# EAGLE design base_cdh1.0 (EAGLE 5.00)

## Sheet 1 of 2
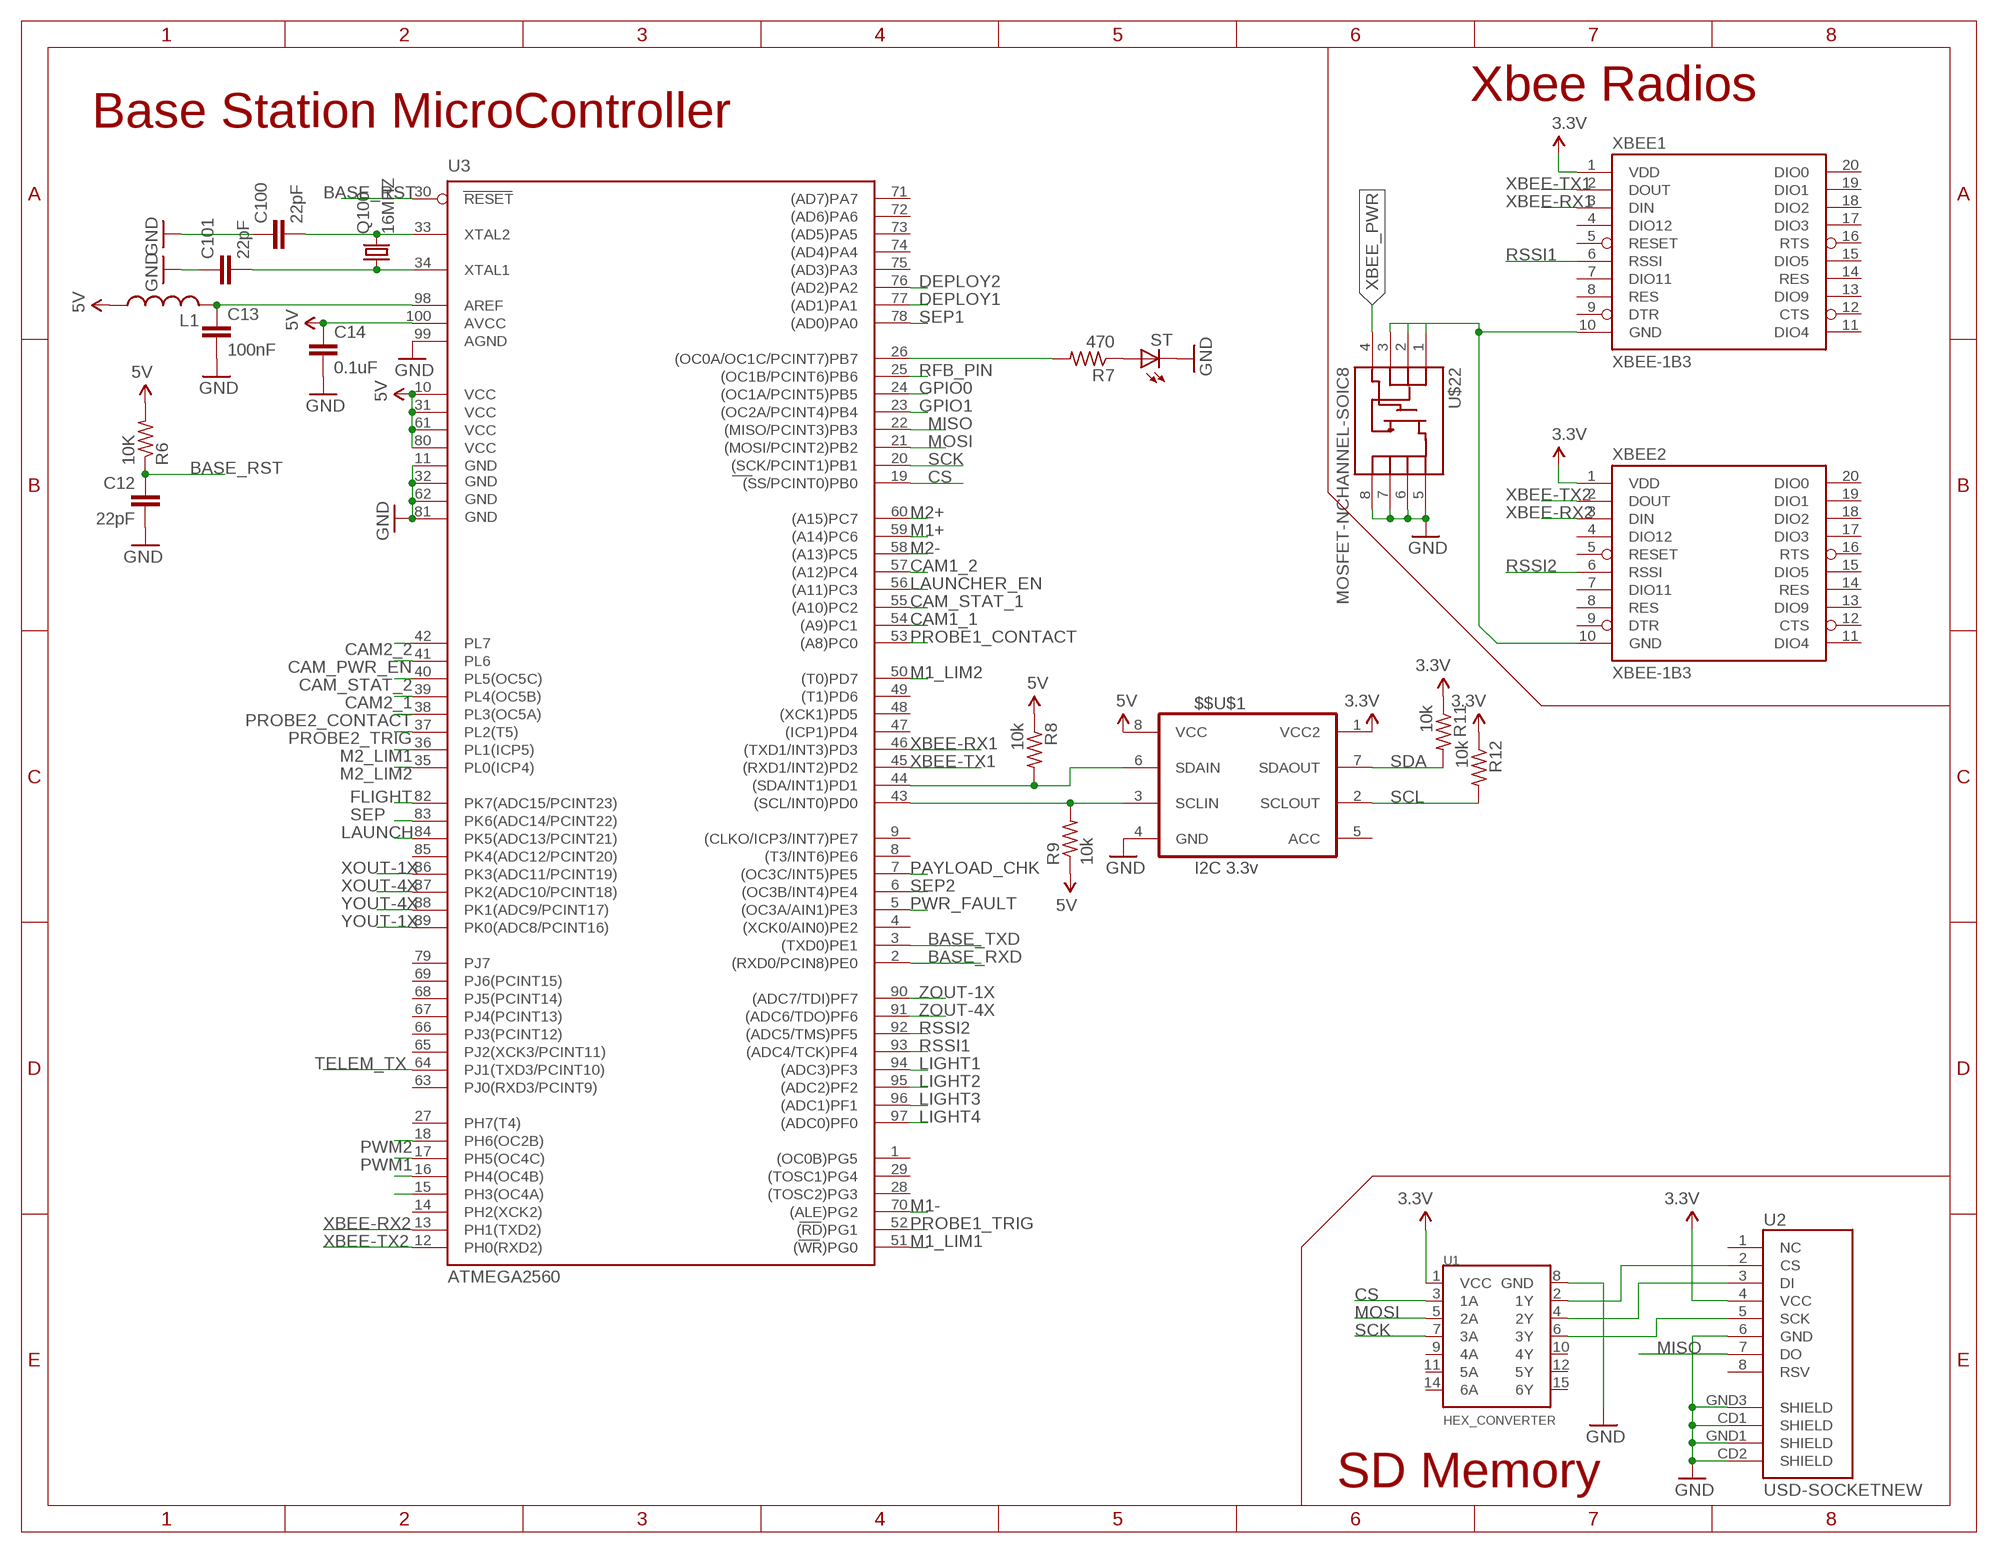
[diagram p0: schematic, sheet 1]

### Parts
$$U$1  I2C 3.3v  CUSTOM2_PCA9512A  [CUSTOM2_SO08]
C12  22pF  C-EUC0805K  [C0805K]
C13  100nF  C-EUC0805K  [C0805K]
C14  0.1uF  C-EUC0805K  [C0805K]
C100  22pF  C-EUC0805K  [C0805K]
C101  22pF  C-EUC0805K  [C0805K]
L1  L-USL2012C  [L2012C]
Q100  16MHZ  CRYSTAL5X3  [CRYSTAL-SMD-5X3]
R6  10K  R-US_M0805  [M0805]
R7  470  R-US_M0805  [M0805]
R8  10k  R-US_M0805  [M0805]
R9  10k  R-US_M0805  [M0805]
R11  10k  R-US_M0805  [M0805]
R12  10k  R-US_M0805  [M0805]
ST  LED1206  [LED-1206]
U1  HEX_CONVERTER  [SO016]
U2  USD-SOCKETNEW  [MICRO-SD-SOCKET-PP]
U3  ATMEGA2560  ATMEGA2560-16AU  [TQFP100]
U$22  MOSFET-NCHANNEL-SOIC8  [SO08]
XBEE1  XBEE-1B3  [XBEE-SMD]
XBEE2  XBEE-1B3  [XBEE-SMD]

### Nets
3.3V: $$U$1.1(VCC2) R11.1 R12.1 U1.1(VCC) U2.4(VCC) XBEE1.1(VDD) XBEE2.1(VDD) ; also sheet 2
5V: $$U$1.8(VCC) C14.1 L1.1 R6.2 R8.1 R9.1 U3.10(VCC) U3.31(VCC1) U3.61(VCC2) U3.80(VCC3) U3.100(AVCC) ; also sheet 2
BASE_RST: C12.1 R6.1 U3.30(RESET) ; also sheet 2
BASE_RXD: U3.2((RXD0/PCIN8)PE0) ; also sheet 2
BASE_TXD: U3.3((TXD0)PE1) ; also sheet 2
CAM1_1: U3.54((A9)PC1) ; also sheet 2
CAM1_2: U3.57((A12)PC4) ; also sheet 2
CAM2_1: U3.39(PL4(OC5B)) ; also sheet 2
CAM2_2: U3.42(PL7) ; also sheet 2
CAM_PWR_EN: U3.41(PL6) ; also sheet 2
CAM_STAT_1: U3.55((A10)PC2) ; also sheet 2
CAM_STAT_2: U3.40(PL5(OC5C)) ; also sheet 2
CS: U1.3(1A) U3.19((SS/PCINT0)PB0)
DEPLOY1: U3.77((AD1)PA1) ; also sheet 2
DEPLOY2: U3.76((AD2)PA2) ; also sheet 2
FLIGHT: U3.82(PK7(ADC15/PCINT23)) ; also sheet 2
GND: $$U$1.4(GND) C12.2 C13.2 C14.2 C100.1 C101.1 ST.C U1.8(GND) U2.6(GND) U2.CD1(SHIELD) U2.CD2(SHIELD) U2.GND1(SHIELD) U2.GND3(SHIELD) U3.11(GND) U3.32(GND1) U3.62(GND2) U3.81(GND3) U3.99(AGND) U$22.5(D) U$22.6(D) U$22.7(D) U$22.8(D) ; also sheet 2
GPIO0: U3.24((OC1A/PCINT5)PB5) ; also sheet 2
GPIO1: U3.23((OC2A/PCINT4)PB4) ; also sheet 2
GPIO2: U3.16(PH4(OC4B)) ; also sheet 2
GPIO3: U3.15(PH3(OC4A)) ; also sheet 2
LAUNCH: U3.84(PK5(ADC13/PCINT21)) ; also sheet 2
LAUNCHER_EN: U3.56((A11)PC3) ; also sheet 2
LIGHT1: U3.94((ADC3)PF3) ; also sheet 2
LIGHT2: U3.95((ADC2)PF2) ; also sheet 2
LIGHT3: U3.96((ADC1)PF1) ; also sheet 2
LIGHT4: U3.97((ADC0)PF0) ; also sheet 2
M1+: U3.59((A14)PC6) ; also sheet 2
M1-: U3.70((ALE)PG2) ; also sheet 2
M1_LIM1: U3.51((WR)PG0) ; also sheet 2
M1_LIM2: U3.50((T0)PD7) ; also sheet 2
M2+: U3.60((A15)PC7) ; also sheet 2
M2-: U3.58((A13)PC5) ; also sheet 2
M2_LIM1: U3.36(PL1(ICP5)) ; also sheet 2
M2_LIM2: U3.35(PL0(ICP4)) ; also sheet 2
MISO: U2.7(DO) U3.22((MISO/PCINT3)PB3) ; also sheet 2
MOSI: U1.5(2A) U3.21((MOSI/PCINT2)PB2) ; also sheet 2
N$5: $$U$1.3(SCLIN) R9.2 U3.43((SCL/INT0)PD0)
N$7: C13.1 L1.2 U3.98(AREF)
N$9: $$U$1.6(SDAIN) R8.2 U3.44((SDA/INT1)PD1)
N$10: U1.2(1Y) U2.2(CS)
N$11: U1.4(2Y) U2.3(DI)
N$12: U1.6(3Y) U2.5(SCK)
N$13: C100.2 Q100.3 U3.33(XTAL2)
N$14: C101.2 Q100.1 U3.34(XTAL1)
N$29: R7.2 U3.26((OC0A/OC1C/PCINT7)PB7)
N$30: R7.1 ST.A
N$53: U$22.1(S) U$22.2(S) U$22.3(S) XBEE1.10(GND) XBEE2.10(GND)
PAYLOAD_CHK: U3.7((OC3C/INT5)PE5) ; also sheet 2
PROBE1_CONTACT: U3.53((A8)PC0) ; also sheet 2
PROBE1_TRIG: U3.52((RD)PG1) ; also sheet 2
PROBE2_CONTACT: U3.38(PL3(OC5A)) ; also sheet 2
PROBE2_TRIG: U3.37(PL2(T5)) ; also sheet 2
PWM1: U3.17(PH5(OC4C)) ; also sheet 2
PWM2: U3.18(PH6(OC2B)) ; also sheet 2
PWR_FAULT: U3.5((OC3A/AIN1)PE3) ; also sheet 2
RFB_PIN: U3.25((OC1B/PCINT6)PB6) ; also sheet 2
RSSI1: U3.93((ADC4/TCK)PF4) XBEE1.6(RSSI) ; also sheet 2
RSSI2: U3.92((ADC5/TMS)PF5) XBEE2.6(RSSI) ; also sheet 2
SCK: U1.7(3A) U3.20((SCK/PCINT1)PB1) ; also sheet 2
SCL: $$U$1.2(SCLOUT) R12.2 ; also sheet 2
SDA: $$U$1.7(SDAOUT) R11.2 ; also sheet 2
SEP: U3.83(PK6(ADC14/PCINT22)) ; also sheet 2
SEP1: U3.78((AD0)PA0) ; also sheet 2
SEP2: U3.6((OC3B/INT4)PE4) ; also sheet 2
TELEM_TX: U3.64(PJ1(TXD3/PCINT10)) ; also sheet 2
XBEE-RX1: U3.46((TXD1/INT3)PD3) XBEE1.3(DIN)
XBEE-RX2: U3.13(PH1(TXD2)) XBEE2.3(DIN)
XBEE-TX1: U3.45((RXD1/INT2)PD2) XBEE1.2(DOUT)
XBEE-TX2: U3.12(PH0(RXD2)) XBEE2.2(DOUT)
XBEE_PWR: U$22.4(G)
XOUT-1X: U3.86(PK3(ADC11/PCINT19)) ; also sheet 2
XOUT-4X: U3.87(PK2(ADC10/PCINT18)) ; also sheet 2
YOUT-1X: U3.89(PK0(ADC8/PCINT16)) ; also sheet 2
YOUT-4X: U3.88(PK1(ADC9/PCINT17)) ; also sheet 2
ZOUT-1X: U3.90((ADC7/TDI)PF7) ; also sheet 2
ZOUT-4X: U3.91((ADC6/TDO)PF6) ; also sheet 2
Unconnected: $$U$1.5(ACC) U1.9(4A) U1.10(4Y) U1.11(5A) U1.12(5Y) U1.14(6A) U1.15(6Y) U2.1(NC) U2.8(RSV) U3.1((OC0B)PG5) U3.4((XCK0/AIN0)PE2) U3.8((T3/INT6)PE6) U3.9((CLKO/ICP3/INT7)PE7) U3.14(PH2(XCK2)) U3.27(PH7(T4)) U3.28((TOSC2)PG3) U3.29((TOSC1)PG4) U3.47((ICP1)PD4) U3.48((XCK1)PD5) U3.49((T1)PD6) U3.63(PJ0(RXD3/PCINT9)) U3.65(PJ2(XCK3/PCINT11)) U3.66(PJ3(PCINT12)) U3.67(PJ4(PCINT13)) U3.68(PJ5(PCINT14)) U3.69(PJ6(PCINT15)) U3.71((AD7)PA7) U3.72((AD6)PA6) U3.73((AD5)PA5) U3.74((AD4)PA4) U3.75((AD3)PA3) U3.79(PJ7) U3.85(PK4(ADC12/PCINT20)) XBEE1.4(DIO12) XBEE1.5(RESET) XBEE1.7(DIO11) XBEE1.8(RES) XBEE1.9(DTR) XBEE1.11(DIO4) XBEE1.12(CTS) XBEE1.13(DIO9) XBEE1.14(RES) XBEE1.15(DIO5) XBEE1.16(RTS) XBEE1.17(DIO3) XBEE1.18(DIO2) XBEE1.19(DIO1) XBEE1.20(DIO0) XBEE2.4(DIO12) XBEE2.5(RESET) XBEE2.7(DIO11) XBEE2.8(RES) XBEE2.9(DTR) XBEE2.11(DIO4) XBEE2.12(CTS) XBEE2.13(DIO9) XBEE2.14(RES) XBEE2.15(DIO5) XBEE2.16(RTS) XBEE2.17(DIO3) XBEE2.18(DIO2) XBEE2.19(DIO1) XBEE2.20(DIO0)

### Notes on the sheet
- Xbee Radios
- Base Station MicroController
- SD Memory

## Sheet 2 of 2
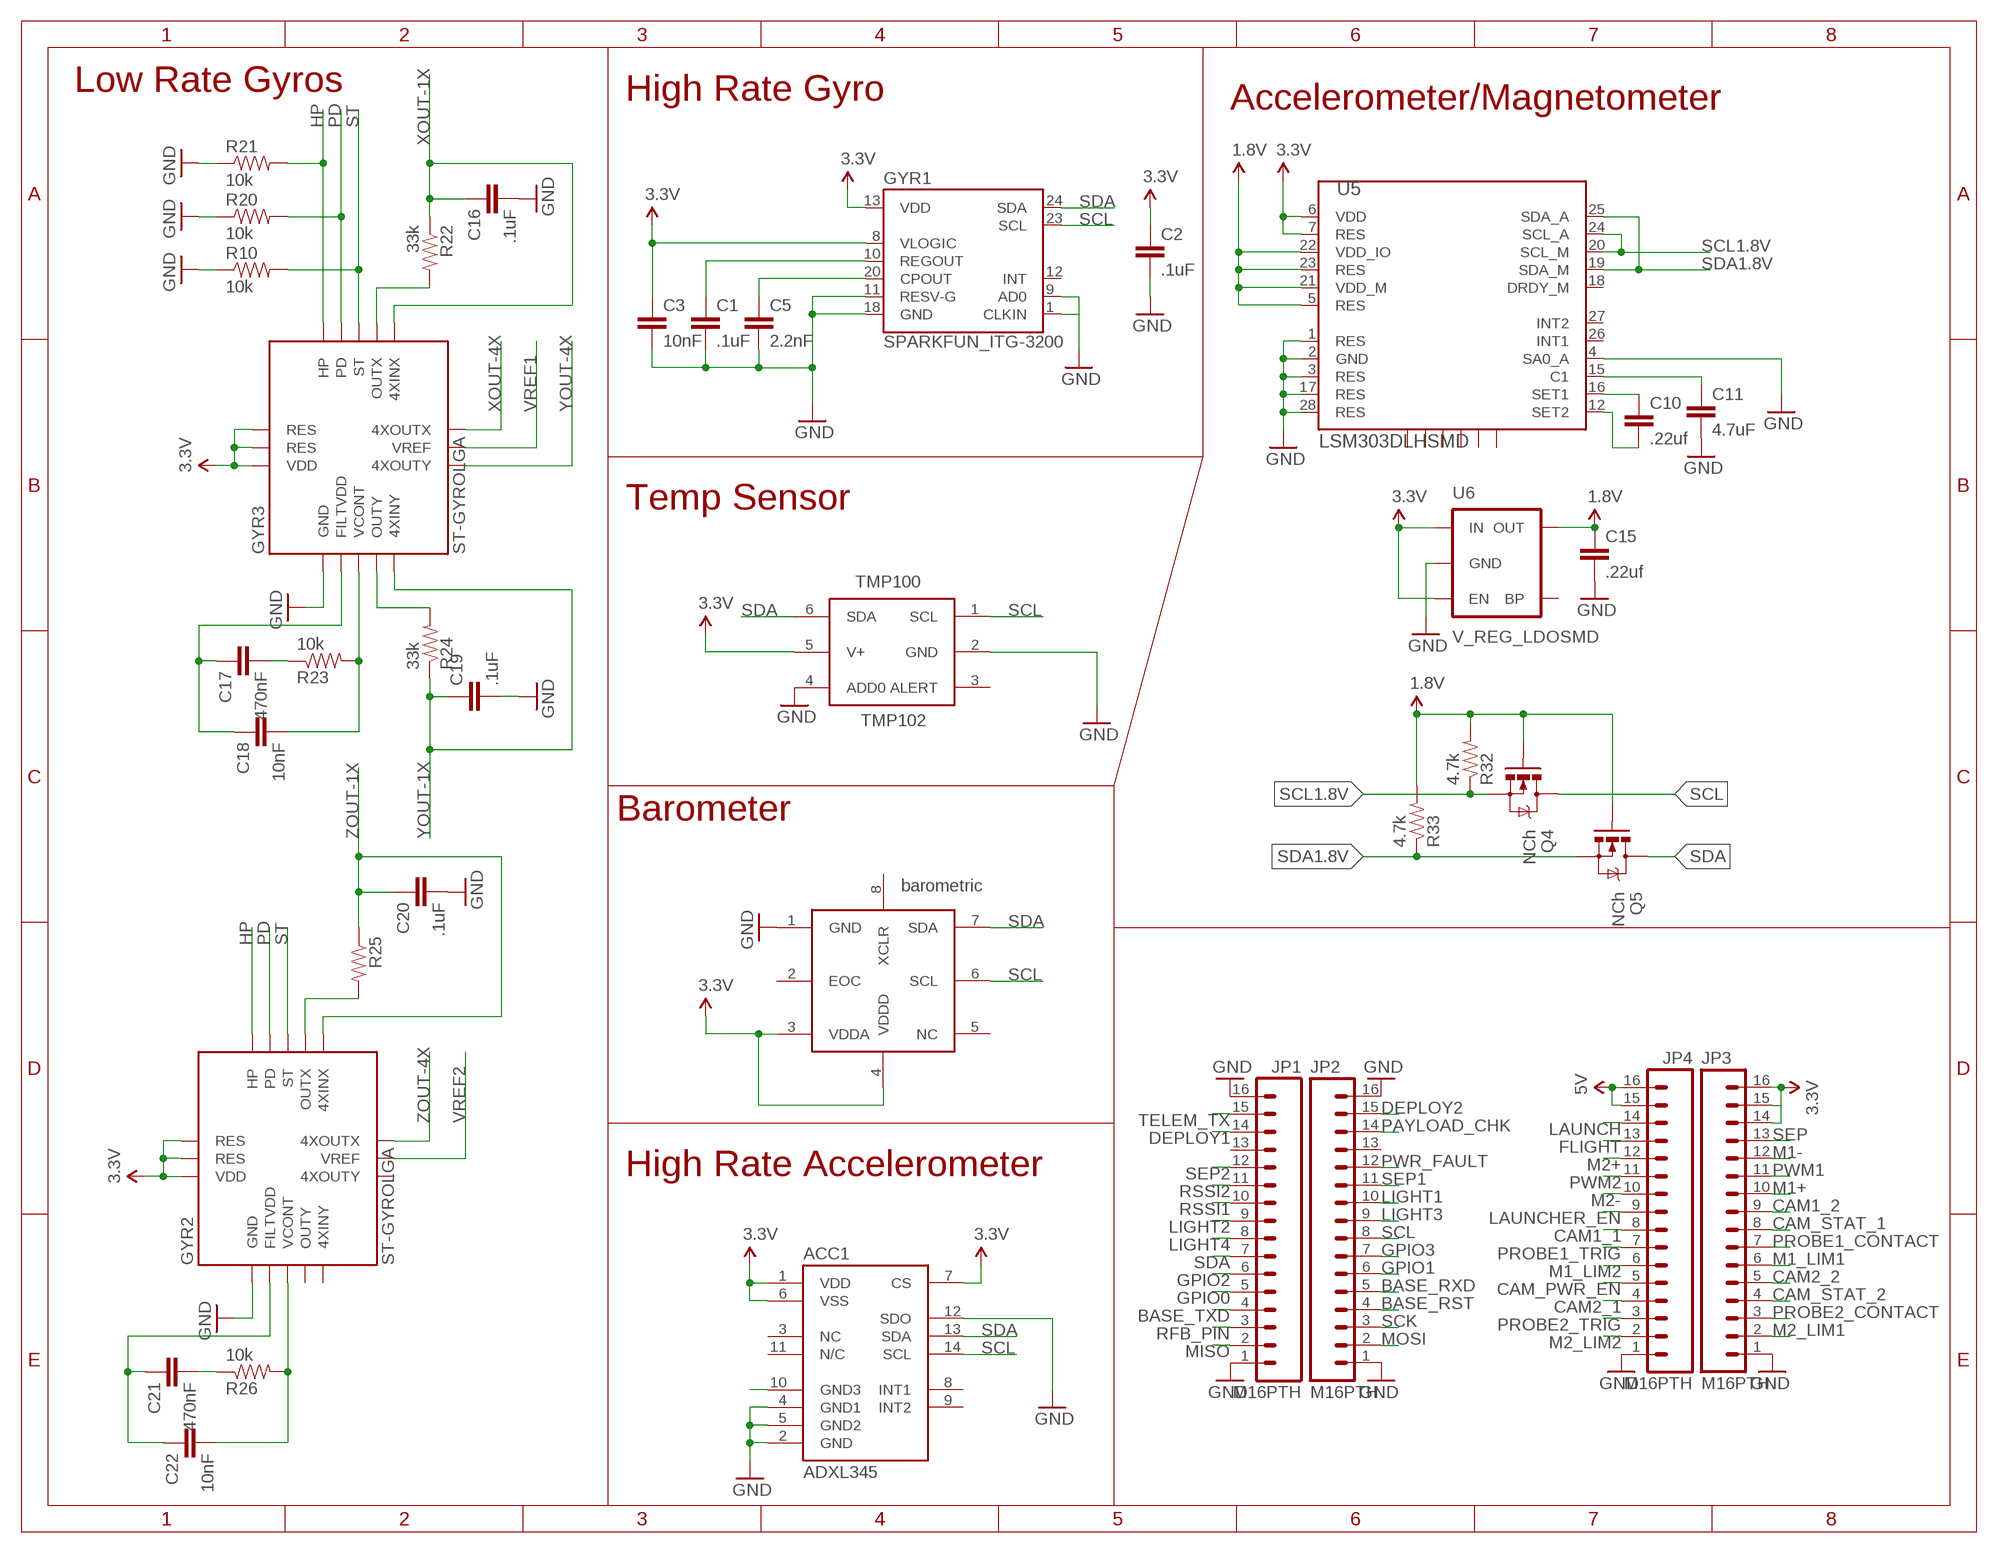
[diagram p1: schematic, sheet 2]

### Parts
ACC1  ADXL345  [LGA14]
BAR100  BMP085  [BMP085]
C1  .1uF  C-EUC0805  [C0805]
C2  .1uF  C-EUC0805  [C0805]
C3  10nF  C-EUC0805  [C0805]
C5  2.2nF  C-EUC0805  [C0805]
C10  .22uf  C-EUC0805  [C0805]
C11  4.7uF  C-EUC0805  [C0805]
C15  .22uf  C-EUC0805  [C0805]
C16  .1uF  C-EUC0805  [C0805]
C17  470nF  C-EUC0805  [C0805]
C18  10nF  C-EUC0805  [C0805]
C19  .1uF  C-EUC0805  [C0805]
C20  .1uF  C-EUC0805  [C0805]
C21  470nF  C-EUC0805  [C0805]
C22  10nF  C-EUC0805  [C0805]
GYR1  SPARKFUN_ITG-3200  [SPARKFUN_QFN-24]
GYR2  ST-GYROLGA  [ST-GYRO]
GYR3  ST-GYROLGA  [ST-GYRO]
JP1  M16PTH  [1X16]
JP2  M16PTH  [1X16]
JP3  M16PTH  [1X16]
JP4  M16PTH  [1X16]
Q4  NCh  MOSFET-NCHANNELSMD  [SOT23-3]
Q5  NCh  MOSFET-NCHANNELSMD  [SOT23-3]
R10  10k  RESISTOR  [0805]
R20  10k  RESISTOR  [0805]
R21  10k  RESISTOR  [0805]
R22  33k  RESISTOR  [0805]
R23  10k  RESISTOR  [0805]
R24  33k  RESISTOR  [0805]
R25  RESISTOR  [0805]
R26  10k  RESISTOR  [0805]
R32  4.7k  RESISTOR  [0805]
R33  4.7k  RESISTOR  [0805]
TMP100  TMP102  [SOT563]
U5  LSM303DLHSMD  [LGA28-5X5]
U6  V_REG_LDOSMD  [SOT23-5]

### Nets
1.8V: C15.1 Q4.1(G) Q5.1(G) R32.2 R33.2 U5.5(RES) U5.21(VDD_M) U5.22(VDD_IO) U5.23(RES) U6.5(OUT)
3.3V: ACC1.1(VDD) ACC1.6(VSS) ACC1.7(CS) BAR100.3(VDDA) BAR100.4(VDDD) C2.1 C3.1 GYR1.8(VLOGIC) GYR1.13(VDD) GYR2.14(RES) GYR2.15(RES) GYR2.16(VDD) GYR3.14(RES) GYR3.15(RES) GYR3.16(VDD) JP3.14 JP3.15 JP3.16 TMP100.5(V+) U5.6(VDD) U5.7(RES) U6.1(IN) U6.3(EN) ; also sheet 1
5V: JP4.15 JP4.16 ; also sheet 1
BASE_RST: JP2.4 ; also sheet 1
BASE_RXD: JP2.5 ; also sheet 1
BASE_TXD: JP1.4 ; also sheet 1
CAM1_1: JP4.8 ; also sheet 1
CAM1_2: JP3.9 ; also sheet 1
CAM2_1: JP4.4 ; also sheet 1
CAM2_2: JP3.5 ; also sheet 1
CAM_PWR_EN: JP4.5 ; also sheet 1
CAM_STAT_1: JP3.8 ; also sheet 1
CAM_STAT_2: JP3.4 ; also sheet 1
DEPLOY1: JP1.14 ; also sheet 1
DEPLOY2: JP2.15 ; also sheet 1
FLIGHT: JP4.13 ; also sheet 1
GND: ACC1.2(GND) ACC1.4(GND1) ACC1.5(GND2) ACC1.12(SDO) BAR100.1(GND) C1.2 C2.2 C3.2 C5.2 C11.2 C15.2 C16.2 C19.2 C20.2 GYR1.1(CLKIN) GYR1.9(AD0) GYR1.11(RESV-G) GYR1.18(GND) GYR2.1(GND) GYR3.1(GND) JP1.1 JP1.16 JP2.1 JP2.16 JP3.1 JP4.1 R10.1 R20.1 R21.1 TMP100.2(GND) TMP100.4(ADD0) U5.1(RES) U5.2(GND) U5.3(RES) U5.4(SA0_A) U5.17(RES) U5.28(RES) U6.2(GND) ; also sheet 1
GPIO0: JP1.5 ; also sheet 1
GPIO1: JP2.6 ; also sheet 1
GPIO2: JP1.6 ; also sheet 1
GPIO3: JP2.7 ; also sheet 1
HP: GYR2.13(HP) GYR3.13(HP) R21.2
LAUNCH: JP4.14 ; also sheet 1
LAUNCHER_EN: JP4.9 ; also sheet 1
LIGHT1: JP2.10 ; also sheet 1
LIGHT2: JP1.9 ; also sheet 1
LIGHT3: JP2.9 ; also sheet 1
LIGHT4: JP1.8 ; also sheet 1
M1+: JP3.10 ; also sheet 1
M1-: JP3.12 ; also sheet 1
M1_LIM1: JP3.6 ; also sheet 1
M1_LIM2: JP4.6 ; also sheet 1
M2+: JP4.12 ; also sheet 1
M2-: JP4.10 ; also sheet 1
M2_LIM1: JP3.2 ; also sheet 1
M2_LIM2: JP4.2 ; also sheet 1
MISO: JP1.2 ; also sheet 1
MOSI: JP2.2 ; also sheet 1
N$17: C10.1 U5.16(SET1)
N$20: ACC1.10(GND3)
N$21: C5.1 GYR1.20(CPOUT)
N$22: C1.1 GYR1.10(REGOUT)
N$24: C10.2 U5.12(SET2)
N$27: C11.1 U5.15(C1)
N$28: GYR3.10(OUTX) R22.2
N$31: C17.1 C18.1 GYR3.2(FILTVDD)
N$32: C17.2 R23.1
N$33: C18.2 GYR3.3(VCONT) R23.2
N$34: GYR3.4(OUTY) R24.2
N$42: GYR2.10(OUTX) R25.2
N$45: C21.1 C22.1 GYR2.2(FILTVDD)
N$46: C21.2 R26.1
N$47: C22.2 GYR2.3(VCONT) R26.2
PAYLOAD_CHK: JP2.14 ; also sheet 1
PD: GYR2.12(PD) GYR3.12(PD) R20.2
PROBE1_CONTACT: JP3.7 ; also sheet 1
PROBE1_TRIG: JP4.7 ; also sheet 1
PROBE2_CONTACT: JP3.3 ; also sheet 1
PROBE2_TRIG: JP4.3 ; also sheet 1
PWM1: JP3.11 ; also sheet 1
PWM2: JP4.11 ; also sheet 1
PWR_FAULT: JP2.12 ; also sheet 1
RFB_PIN: JP1.3 ; also sheet 1
RSSI1: JP1.10 ; also sheet 1
RSSI2: JP1.11 ; also sheet 1
SCK: JP2.3 ; also sheet 1
SCL: ACC1.14(SCL) BAR100.6(SCL) GYR1.23(SCL) JP2.8 Q4.3(D) TMP100.1(SCL) ; also sheet 1
SCL1.8V: Q4.2(S) R32.1 U5.20(SCL_M) U5.24(SCL_A)
SDA: ACC1.13(SDA) BAR100.7(SDA) GYR1.24(SDA) JP1.7 Q5.3(D) TMP100.6(SDA) ; also sheet 1
SDA1.8V: Q5.2(S) R33.1 U5.19(SDA_M) U5.25(SDA_A)
SEP: JP3.13 ; also sheet 1
SEP1: JP2.11 ; also sheet 1
SEP2: JP1.12 ; also sheet 1
ST: GYR2.11(ST) GYR3.11(ST) R10.2
TELEM_TX: JP1.15 ; also sheet 1
VREF1: GYR3.7(VREF)
VREF2: GYR2.7(VREF)
XOUT-1X: C16.1 GYR3.9(4XINX) R22.1 ; also sheet 1
XOUT-4X: GYR3.8(4XOUTX) ; also sheet 1
YOUT-1X: C19.1 GYR3.5(4XINY) R24.1 ; also sheet 1
YOUT-4X: GYR3.6(4XOUTY) ; also sheet 1
ZOUT-1X: C20.1 GYR2.9(4XINX) R25.1 ; also sheet 1
ZOUT-4X: GYR2.8(4XOUTX) ; also sheet 1
Unconnected: ACC1.3(NC) ACC1.8(INT1) ACC1.9(INT2) ACC1.11(N/C) BAR100.2(EOC) BAR100.5(NC) BAR100.8(XCLR) GYR1.12(INT) GYR2.4(OUTY) GYR2.5(4XINY) GYR2.6(4XOUTY) JP1.13 JP2.13 TMP100.3(ALERT) U5.8(NC) U5.9(NC) U5.10(RES) U5.11(RES) U5.13(RES) U5.14(RES) U5.18(DRDY_M) U5.26(INT1) U5.27(INT2) U6.4(BP)

### Notes on the sheet
- Low Rate Gyros | High Rate Gyro
- Accelerometer/Magnetometer
- Temp Sensor
- Barometer
- barometric
- High Rate Accelerometer

## Library data of the parts
$$U$1 = interface-rev1_2:CUSTOM2_PCA9512A: Level Shifting I2C Voltage Translator
ACC1 = SparkFun:ADXL345
BAR100 = SparkFun:BMP085
C1-C3 C5 C10-C22 C100 C101 = rcl:C-EU: CAPACITOR, European symbol
GYR1 = 9DoF-Stick-v12:SPARKFUN_ITG-3200: ITG-3200 3-axis gyro, digital output, qfn24 package
GYR2 GYR3 = SparkFun3:ST-GYRO
JP1-JP4 = SparkFun:M16
L1 = rcl:L-US: INDUCTOR, American symbol
Q4 Q5 = SparkFun:MOSFET-NCHANNEL
Q100 = SparkFun:CRYSTAL: Crystals Various standard crystals. Proven footprints. Spark Fun Electronics SKU : COM-00534
R6-R9 R11 R12 = rcl:R-US_: RESISTOR, American symbol
R10 R20-R26 R32 R33 = SparkFun3:RESISTOR: Resistor Basic schematic elements and footprints for 0603, 1206, and PTH 1/10th watt (small) resistors.
ST = SparkFun:LED: LEDs Standard schematic elements and footprints for 5mm, 3mm, 1206, and 0603 sized LEDs. 5mm - Spark Fun Electronics SKU : COM-00529 (and others)
TMP100 = SparkFun:TMP102
U1 = SparkFun:HEX_CONVERTER
U2 = SparkFun:USD-SOCKET: microSD Socket Push-push type uSD socket. Schematic element and footprint production proven. Spark Fun Electronics SKU : PRT-00127. tDoc lines correctly indicate media card edge positions when inserting (unlocked, locked, depressed).
U3 = atmel-2005:ATMEGA*: MICROCONTROLLER 64/128/256 Kbytes FLASH 4 Kbytes EEPROM 8 Kbytes SRAM 86 General Purpose I/O pins 12-channels16-bit PWM 4 x Serial USARTs 16-channels 10-bit A/D
U5 = SparkFun:LSM303DLH
U6 = SparkFun:V_REG_LDO: Voltage Regulator LDO Standard 150mA LDO voltage regulator in SOT-23 layout. Micrel part MIC5205. BP (by-pass) pin is used to lower output noise with 470pF cap.
U$22 = SparkFun:MOSFET-NCHANNEL-SOIC8: N-Channel MOSFET IRF9410 and NDS8434 are common, SOIC-8 parts.
XBEE1 XBEE2 = SparkFun:XBEE-1

## Board
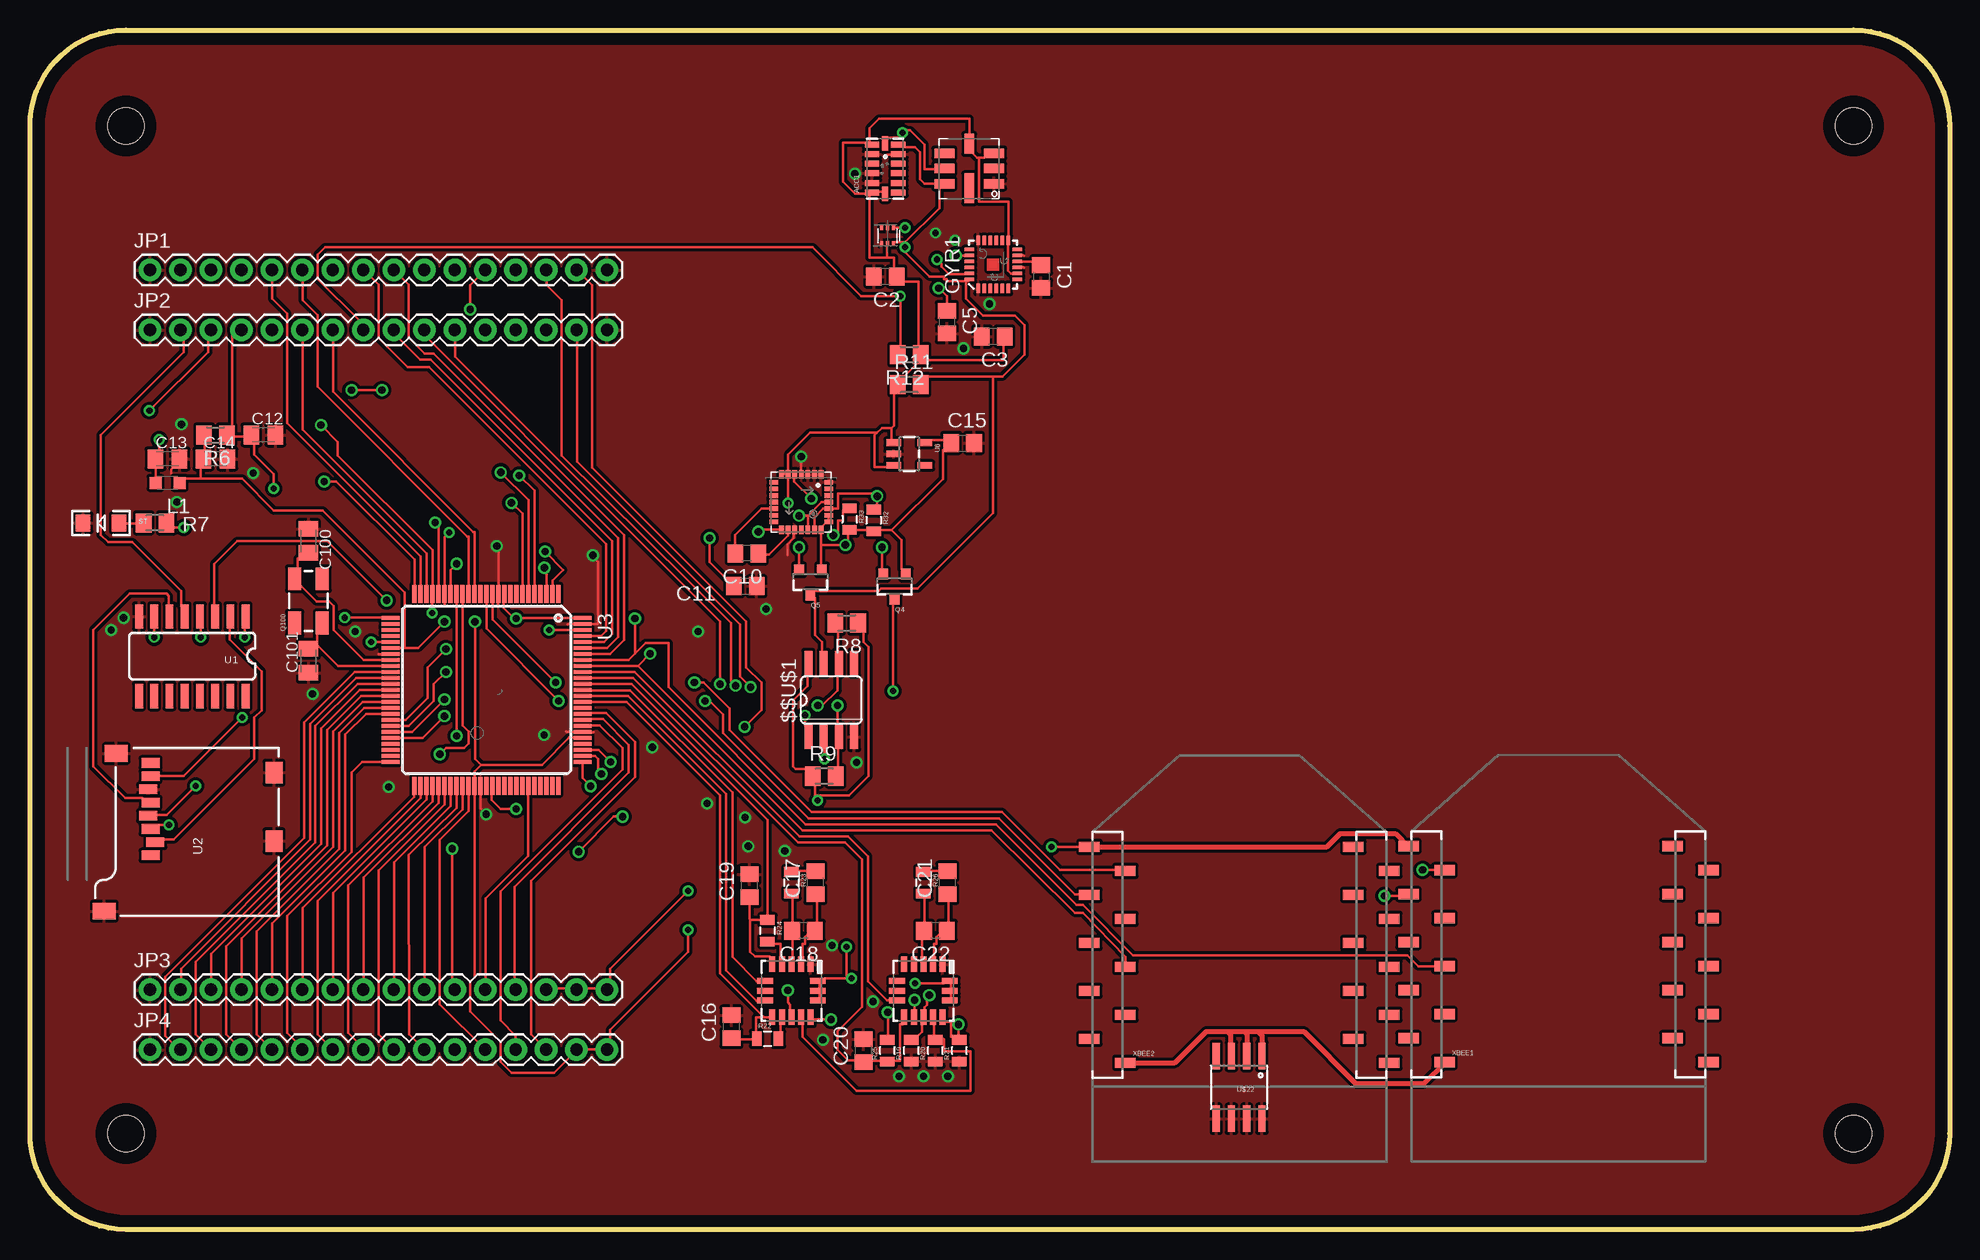
[diagram p2: board, top side]
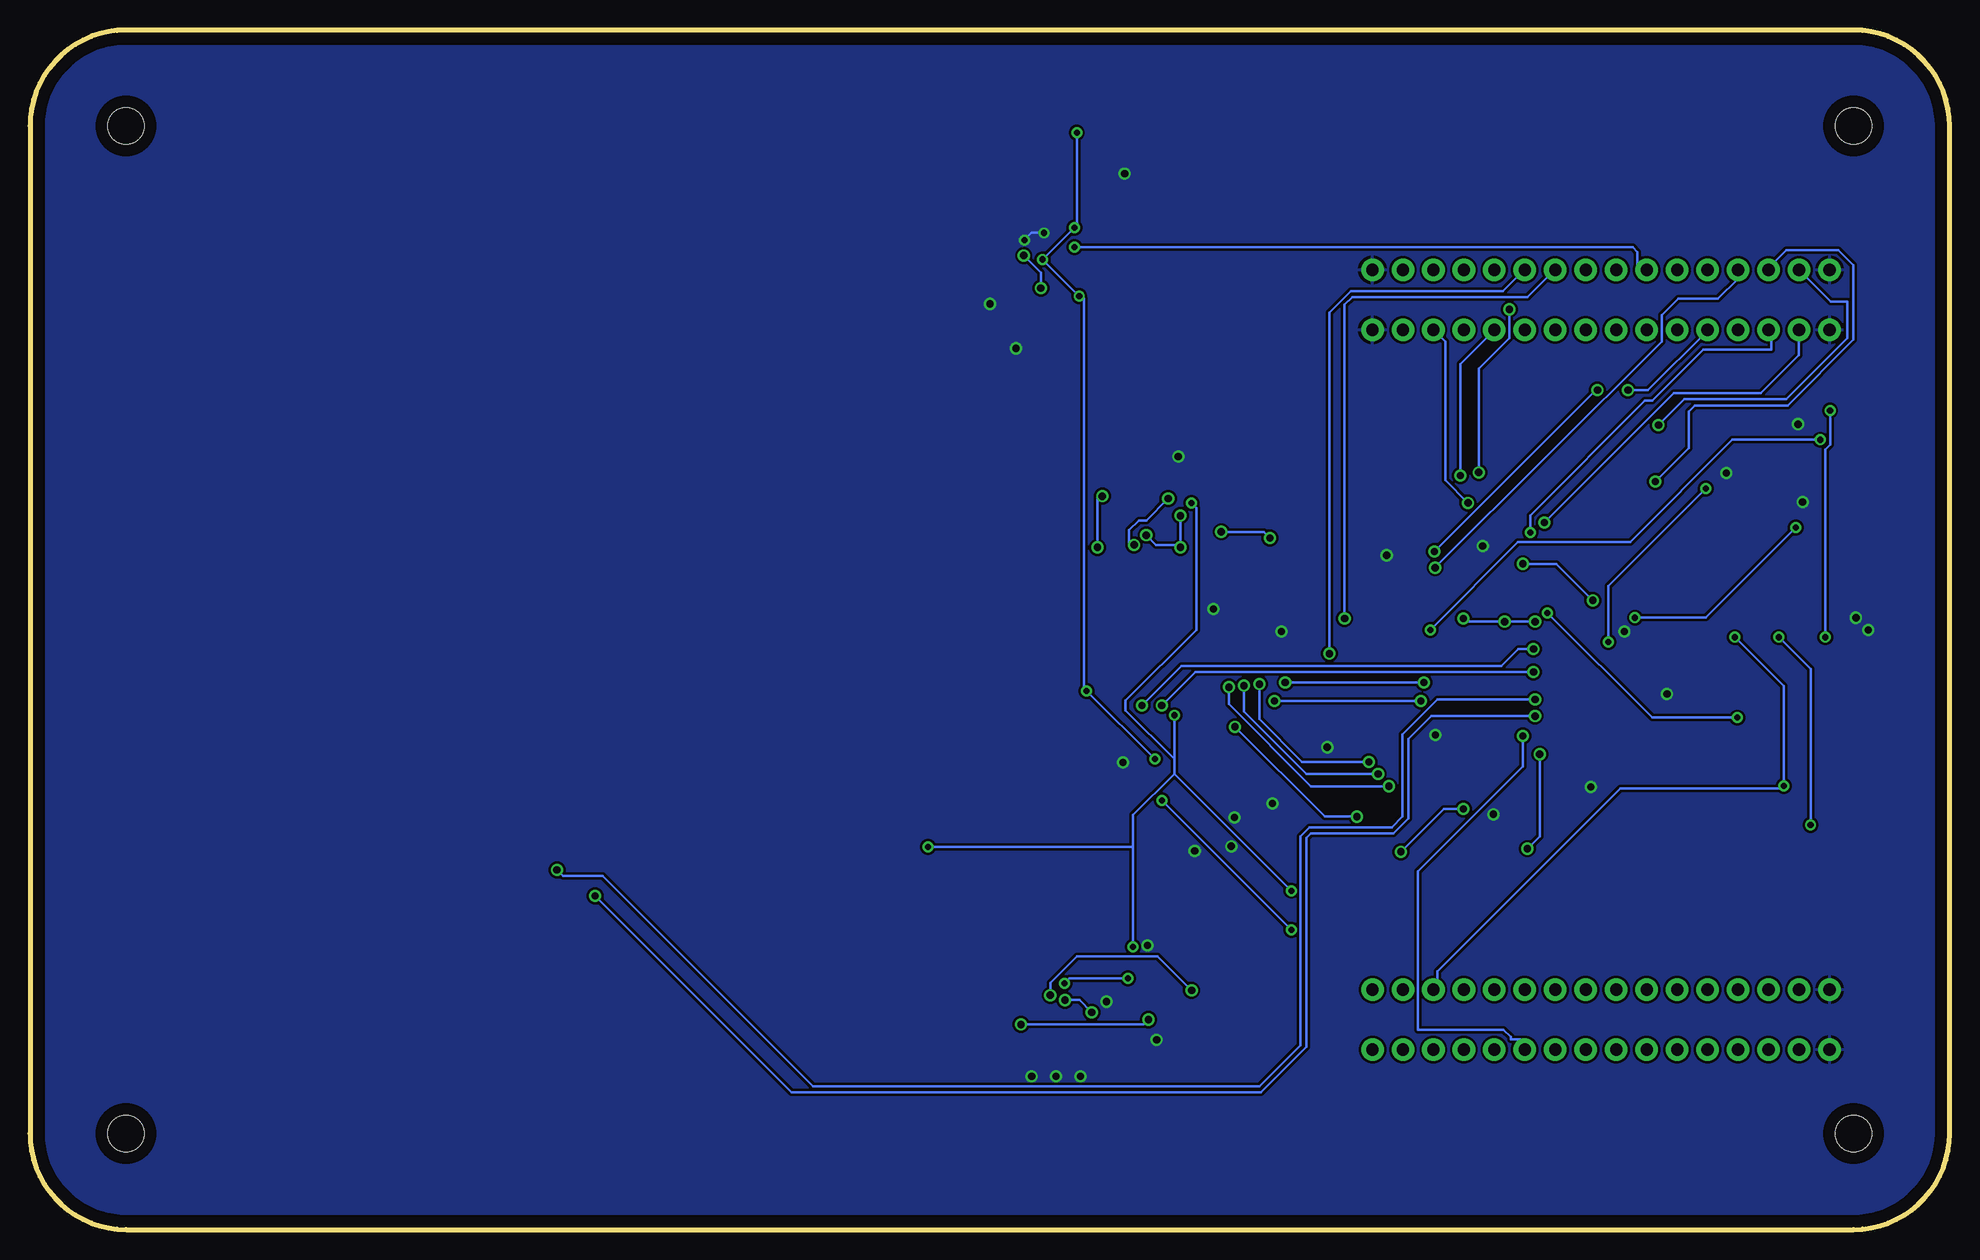
[diagram p3: board, bottom side, seen from below]

Size 160 x 100 mm. Coordinates in mm from the lower left corner, seen from the top.
Outline: 8,0 arc-90 0,8 0,92 arc-90 8,100 152,100 arc-90 160,92 160,8 arc-90 152,0 8,0
Copper layers (1*16): Top 0.035mm / dielectric 1.5mm / Bottom 0.035mm
Design rules "default *": minimum track width 8mil, minimum drill 20mil, track to track 8mil, track to pad 8mil, pad to pad 4mil, via to via 8mil, smd to smd 8mil, copper to edge 40mil, drill to drill 8mil, minimum pad ring 10mil, minimum via ring 8mil, stop-mask expansion 10mil, vias tented up to drill 25mil, thermal gap 10mil
Holes 3 mm at 8,8 152,8 152,92 8,92

### Footprints (pad centres in the part's own frame; a part is rotated, then mirrored left to right if it is on the bottom)
CUSTOM2_SO08 = smd 0.66 x 2.032: 1 -1.905,-3.073; 2 -0.635,-3.073; 3 0.635,-3.073; 4 1.905,-3.073; 5 1.905,3.073; 6 0.635,3.073; 7 -0.635,3.073; 8 -1.905,3.073
LGA14 = smd 0.5 x 1.2: 1 2,1.1; 2 1.2,1.1; 3 0.4,1.1; 4 -0.4,1.1; 5 -1.2,1.1; 6 -2,1.1; 8 -2,-1.1; 9 -1.2,-1.1; 10 -0.4,-1.1; 11 0.4,-1.1; 12 1.2,-1.1; 13 2,-1.1 | smd 1.2 x 0.5: 7 -2.1,0; 14 2.1,0
BMP085 = smd 1.67 x 0.8: 1 -2.065,1.27; 2 -2.065,0; 3 -2.065,-1.27; 5 2.065,-1.27; 6 2.065,0; 7 2.065,1.27 | smd 0.8 x 1.67: 4 0,-2.065 | smd 0.8 x 2.5: 8 0,1.65
C0805 = smd 1.3 x 1.5: 1 -0.95,0; 2 0.95,0
C0805K = smd 1.3 x 1.6: 1 -1,0; 2 1,0
SPARKFUN_QFN-24 = smd 0.8 x 0.3: 1 -2,1.25; 2 -2,0.75; 3 -2,0.25; 4 -2,-0.25; 5 -2,-0.75; 6 -2,-1.25; 13 2,-1.25; 14 2,-0.75; 15 2,-0.25; 16 2,0.25; 17 2,0.75; 18 2,1.25 | smd 0.3 x 0.8: 7 -1.25,-2; 8 -0.75,-2; 9 -0.25,-2; 10 0.25,-2; 11 0.75,-2; 12 1.25,-2; 19 1.25,2; 20 0.75,2; 21 0.25,2; 22 -0.25,2; 23 -0.75,2; 24 -1.25,2
ST-GYRO = smd 1.3 x 0.5: 1 -2.2,1.6; 2 -2.2,0.8; 3 -2.2,0; 4 -2.2,-0.8; 5 -2.2,-1.6; 9 2.2,-1.6; 10 2.2,-0.8; 11 2.2,0; 12 2.2,0.8; 13 2.2,1.6 | smd 0.5 x 1.3: 6 -0.8,-2.2; 7 0,-2.2; 8 0.8,-2.2; 14 0.8,2.2; 15 0,2.2; 16 -0.8,2.2
1X16 = drill 1.016 pad 1.88 round: 1 0,0; 2 2.54,0; 3 5.08,0; 4 7.62,0; 5 10.16,0; 6 12.7,0; 7 15.24,0; 8 17.78,0; 9 20.32,0; 10 22.86,0; 11 25.4,0; 12 27.94,0; 13 30.48,0; 14 33.02,0; 15 35.56,0; 16 38.1,0
L2012C = smd 1 x 1: 1 -1,0; 2 1,0
SOT23-3 = smd 0.8 x 0.9: 1 -0.95,-1; 2 0.95,-1; 3 0,1.1
CRYSTAL-SMD-5X3 = smd 1.9 x 1.1: 1 -1.85,-1.15; 2 1.85,-1.15; 3 1.85,1.15; 4 -1.85,1.15
M0805 = smd 1.3 x 1.6: 1 -0.95,0; 2 0.95,0
0805 = smd 0.8 x 1.2: 1 -0.9,0; 2 0.9,0
LED-1206 = smd 1.2 x 1.4: A -1.5,0; C 1.5,0
SOT563 = smd 0.25 x 0.4: 1 0.3,-0.06; 2 0.8,-0.06; 3 1.3,-0.06; 4 1.3,1.26; 5 0.8,1.26; 6 0.3,1.27
SO016 = smd 0.66 x 2.032: 1 -4.445,-3.315; 2 -3.175,-3.315; 3 -1.905,-3.315; 4 -0.635,-3.315; 5 0.635,-3.315; 6 1.905,-3.315; 7 3.175,-3.315; 8 4.445,-3.315; 9 4.445,3.315; 10 3.175,3.315; 11 1.905,3.315; 12 0.635,3.315; 13 -0.635,3.315; 14 -1.905,3.315; 15 -3.175,3.315; 16 -4.445,3.315
MICRO-SD-SOCKET-PP = smd 0.8 x 1.5: 1 -8.94,10.7; 2 -7.84,10.3; 3 -6.74,10.7; 4 -5.64,10.9; 5 -4.54,10.7; 6 -3.44,10.9; 7 -2.34,10.7; 8 -1.24,10.7 | smd 1.8 x 1.4: CD1 -2.05,0.4; CD2 -7.75,0.4 | smd 1.4 x 1.9: GND1 -13.6,14.55; GND3 -0.45,13.55
TQFP100 = smd 1.5 x 0.35: 1 -8,6; 2 -8,5.5; 3 -8,5; 4 -8,4.5; 5 -8,4; 6 -8,3.5; 7 -8,3; 8 -8,2.5; 9 -8,2; 10 -8,1.5; 11 -8,1; 12 -8,0.5; 13 -8,0; 14 -8,-0.5; 15 -8,-1; 16 -8,-1.5; 17 -8,-2; 18 -8,-2.5; 19 -8,-3; 20 -8,-3.5; 21 -8,-4; 22 -8,-4.5; 23 -8,-5; 24 -8,-5.5; 25 -8,-6; 51 8,-6; 52 8,-5.5; 53 8,-5; 54 8,-4.5; 55 8,-4; 56 8,-3.5; 57 8,-3; 58 8,-2.5; 59 8,-2; 60 8,-1.5; 61 8,-1; 62 8,-0.5; 63 8,0; 64 8,0.5; 65 8,1; 66 8,1.5; 67 8,2; 68 8,2.5; 69 8,3; 70 8,3.5; 71 8,4; 72 8,4.5; 73 8,5; 74 8,5.5; 75 8,6 | smd 0.35 x 1.5: 26 -6,-8; 27 -5.5,-8; 28 -5,-8; 29 -4.5,-8; 30 -4,-8; 31 -3.5,-8; 32 -3,-8; 33 -2.5,-8; 34 -2,-8; 35 -1.5,-8; 36 -1,-8; 37 -0.5,-8; 38 0,-8; 39 0.5,-8; 40 1,-8; 41 1.5,-8; 42 2,-8; 43 2.5,-8; 44 3,-8; 45 3.5,-8; 46 4,-8; 47 4.5,-8; 48 5,-8; 49 5.5,-8; 50 6,-8; 76 6,8; 77 5.5,8; 78 5,8; 79 4.5,8; 80 4,8; 81 3.5,8; 82 3,8; 83 2.5,8; 84 2,8; 85 1.5,8; 86 1,8; 87 0.5,8; 88 0,8; 89 -0.5,8; 90 -1,8; 91 -1.5,8; 92 -2,8; 93 -2.5,8; 94 -3,8; 95 -3.5,8; 96 -4,8; 97 -4.5,8; 98 -5,8; 99 -5.5,8; 100 -6,8
LGA28-5X5 = smd 0.7 x 0.4: 1 -2.3,1.65; 2 -2.3,1.1; 3 -2.3,0.55; 4 -2.3,0; 5 -2.3,-0.55; 6 -2.3,-1.1; 7 -2.3,-1.65; 15 2.3,-1.65; 16 2.3,-1.1; 17 2.3,-0.55; 18 2.3,0; 19 2.3,0.55; 20 2.3,1.1; 21 2.3,1.65 | smd 0.4 x 0.7: 8 -1.65,-2.3; 9 -1.1,-2.3; 10 -0.55,-2.3; 11 0,-2.3; 12 0.55,-2.3; 13 1.1,-2.3; 14 1.65,-2.3; 22 1.65,2.3; 23 1.1,2.3; 24 0.55,2.3; 25 0,2.3; 26 -0.55,2.3; 27 -1.1,2.3; 28 -1.65,2.3
SOT23-5 = smd 0.55 x 1.2: 1 -0.95,-1.3; 2 0,-1.3; 3 0.95,-1.3; 4 0.95,1.3; 5 -0.95,1.3
SO08 = smd 0.61 x 2.21: 1 -1.905,-2.616; 2 -0.635,-2.616; 3 0.635,-2.616; 4 1.905,-2.616; 5 1.905,2.616; 6 0.635,2.616; 7 -0.635,2.616; 8 -1.905,2.616
XBEE-SMD = smd 1.7 x 0.85: 1 -12.5,20; 2 -9.5,18; 3 -12.5,16; 4 -9.5,14; 5 -12.5,12; 6 -9.5,10; 7 -12.5,8; 8 -9.5,6; 9 -12.5,4; 10 -9.5,2; 11 12.5,2; 12 9.5,4; 13 12.5,6; 14 9.5,8; 15 12.5,10; 16 9.5,12; 17 12.5,14; 18 9.5,16; 19 12.5,18; 20 9.5,20

### Placement (x,y rotation side)
$$U$1  66.79,44.14 0 top
ACC1  71.29,88.45 90 top
BAR100  78.29,88.45 180 top
C1  84.29,79.45 270 top
C2  71.29,79.45 180 top
C3  80.29,74.45 180 top
C5  76.42,75.64 270 top
C10  59.75,56.37 180 top
C11  59.62,53.64 0 top
C12  19.46,66.24 0 top
C13  11.46,64.24 0 top
C14  15.46,64.24 0 top
C15  77.74,65.57 0 top
C16  58.47,16.91 90 top
C17  65.47,28.91 90 top
C18  64.47,24.91 180 top
C19  59.97,28.66 90 top
C20  69.47,14.91 90 top
C21  76.47,28.91 90 top
C22  75.47,24.91 180 top
C100  23.21,57.4 270 top
C101  23.21,47.4 90 top
GYR1  80.29,80.45 90 top
GYR2  74.47,19.91 270 top
GYR3  63.47,19.91 270 top
JP1  10,80 0 top
JP2  10,75 0 top
JP3  10,20 0 top
JP4  10,15 0 top
L1  11.46,62.24 180 top
Q4  72.06,53.64 180 top
Q5  65.05,53.99 180 top
Q100  23.21,52.4 90 top
R6  15.46,66.24 180 top
R7  10.43,58.91 0 top
R8  68.07,50.56 180 top
R9  66.21,37.79 0 top
R10  73.47,14.91 90 top
R11  73.29,70.45 0 top
R12  73.29,72.95 180 top
R20  75.47,14.91 90 top
R21  77.47,14.91 90 top
R22  61.47,15.91 0 top
R23  63.47,28.91 270 top
R24  61.47,24.91 270 top
R25  71.47,14.91 90 top
R26  74.47,28.91 270 top
R32  70.32,59.12 270 top
R33  68.31,59.22 270 top
ST  5.93,58.91 180 top
TMP100  72.29,83.45 180 top
U1  13.53,47.79 180 top
U2  20.74,40.14 90 top
U3  38.04,44.99 270 top
U5  64.29,60.64 270 top
U6  73.29,64.65 270 top
U$22  100.78,11.85 180 top
XBEE1  127.41,11.95 0 top
XBEE2  100.8,11.9 0 top

### Tracks (layer width: path | path; a pad name or v marks a point on that pad's centre or on a via)
1.8V  (via drill 0.61)
  Top 0.203: U5.23 66.55,59.51 66.55,59.11 U5.22 66.34,58.93 65.94,58.52 U5.21 65.94,58.09 65.94,57.07 | 65.94,57.07 65.94,55.24 Q5.1 | 65.94,57.07 v67.97,57.07 68.17,57.07 68.17,58.09 R33.2 68.78,58.29 69.8,58.29 R32.2 70.81,58.29 71.83,58.29 | U6.5 75.08,65.81 76.3,65.81 C15.1 76.3,65 76.1,65 76.1,62.56 71.83,58.29 | v65.13,60.94 63.7,62.36 63.7,62.76 U5.5 | 71.83,58.29 72.64,57.48 72.64,55.04 Q4.1
  Bottom 0.203: v65.13,60.94 66.95,59.11 67.56,59.11 68.38,58.29 68.38,57.07 v67.97,57.07
3.3V  (via drill 0.51)
  Top 0.203: JP3.14 43.89,20.12 44.7,20.12 JP3.15 46.33,20.12 47.35,20.12 JP3.16 48.36,20.93 48.36,21.74 v54.86,28.25 | U5.7 62.69,62.99 63.09,62.99 U5.6 | GYR3.14 65.81,19.33 65.81,19.74 GYR3.15 65.81,20.14 65.81,20.55 GYR3.16 66.24,20.93 v68.48,20.93 68.07,21.13 v68.07,23.57 | GYR2.14 76.78,19.33 76.78,19.74 GYR2.15 76.78,20.14 76.78,20.55 GYR2.16 76.2,20.52 v73.76,20.52 | 79.12,89.36 79.12,85.7 81.56,85.7 81.56,82.65 GYR1.13 81.54,79.93 81.79,79.68 81.8,79.69 GYR1.8 | 79.12,89.36 79.53,89.36 BAR100.3 | 79.12,89.36 78.92,89.36 78.51,89.76 BAR100.4 78.31,91.19 78.31,92.61 70.79,92.61 69.98,91.8 69.98,90.58 ACC1.1 69.6,90.6 67.77,90.6 67.77,87.35 68.78,86.33 69.6,86.33 ACC1.6 | ACC1.7 71.2,86.51 70.59,86.51 ACC1.6 | C3.1 81.15,73.71 81.15,72.49 74.85,72.49 R12.1 | R12.1 74.04,72.29 72.82,71.07 R11.1 72.03,69.67 72.03,67.03 71.83,66.83 | 71.42,81.03 72.01,81.03 72.01,80.01 C2.1 72.85,79.02 74.07,79.02 74.07,73.74 R12.1 | 71.42,81.03 69.98,81.03 69.98,86.31 ACC1.6 | TMP100.5 71.42,82.07 71.42,81.03 | 70.57,66.38 70.41,66.22 70.41,63.58 71.42,63.58 U6.3 | 70.57,66.38 71.02,66.83 71.83,66.83 | 71.83,66.83 71.83,65.81 U6.1 | v13.82,36.98 11.38,34.54 10.57,34.54 U2.4 | v17.88,49.38 17.88,50.19 U1.1 | U5.6 63.2,63.2 63.2,64.62 65.02,66.45 70.51,66.45 70.57,66.38 | v64.62,42.88 64.62,42.06 $$U$1.1 | v63.2,60.55 63.2,62.79 U5.6 | v85.14,31.9 87.58,31.9 XBEE2.1
  Top 0.406: XBEE2.1 108.1,31.9 109.22,33.02 113.79,33.02 114.91,31.91 | 114.91,31.91 114.94,31.88 | 114.91,31.91 XBEE1.1
  Bottom 0.203: v17.88,49.38 13.82,45.31 v13.82,36.98 14.22,36.78 27.43,36.78 42.67,21.54 42.67,20.93 JP3.14 | v68.48,20.93 73.36,20.93 v73.76,20.52 | 64.62,38 64.62,39.22 | 64.62,39.22 v64.62,42.88 | 64.62,38 68.07,34.54 68.07,31.9 | 68.07,31.9 v68.07,23.57 | v63.2,60.55 62.79,60.15 62.79,49.99 68.68,44.09 68.68,43.28 64.62,39.22 | 68.07,31.9 v85.14,31.9 | v54.86,28.25 64.62,38
5V  (via drill 0.51, 0.6)
  Top 0.203: R6.2 14.55,65.48 14.55,64.87 C14.1 14.22,63.6 14.22,62.59 | 37.59,38.73 37.04,38.19 U3.61 37.04,21.04 36.68,20.68 36.68,18.19 39.22,15.65 39.22,13.99 40.13,13.08 43.69,13.08 45.59,14.99 45.58,15 JP4.15 46.33,15.04 47.35,15.04 JP4.16 48.36,15.85 48.36,16.66 54.86,23.16 v54.86,24.99 | 37.59,38.73 42.67,38.73 44.96,41.02 46.1,41.02 46.07,40.99 U3.80 | 40.64,50.99 40.32,50.99 39.5,51.82 39.5,52.96 39.53,52.99 U3.10 | 40.64,50.99 U3.100 | 31.22,48.49 32.36,48.49 v34.54,50.67 | 31.22,48.49 U3.31 | 40.64,50.99 40.64,50.93 v40.51,50.93 | v37.08,50.67 37.08,39.24 37.59,38.73 | $$U$1.8 64.82,46.33 64.82,45.31 63.6,44.09 63.6,38.61 63.8,38.41 64.62,38.41 R9.1 65.43,37.19 65.43,36.17 65.63,36.17 | 65.63,36.17 68.28,36.17 69.9,37.8 69.9,48.56 69.49,48.97 69.49,49.78 R8.1 | 14.22,62.59 12.8,62.59 L1.1 | 14.22,62.59 17.68,62.59 20.32,59.94 24.38,59.94 31.22,53.11 31.22,48.49 | v65.63,35.76 65.63,36.17
  Bottom 0.203: v34.54,50.67 v37.08,50.67 40.26,50.67 v40.51,50.93 | v54.86,24.99 v65.63,35.76
BASE_RST  (via drill 0.51)
  Top 0.203: v28.45,48.97 29.46,48.97 U3.30 | v20.32,61.77 20.32,62.99 18.69,64.62 18.69,65.63 C12.1 18.01,66.09 16.99,66.09 R6.1 16.87,66.85 16.87,74.57 JP2.4
  Bottom 0.203: v28.45,48.97 28.45,53.65 v20.32,61.77
BASE_RXD  (via drill 0.6)
  Top 0.203: v26.8,69.98 v29.34,69.98 | U3.2 43.54,54.08 44.45,54.99 v42.93,56.52
  Bottom 0.203: v42.93,56.52 29.46,69.98 v29.34,69.98 | 20.12,75 20.07,75.06 | JP2.5 20.12,75 | v26.8,69.98 25.15,69.98 20.12,75
BASE_TXD  (via drill 0.6)
  Top 0.203: U3.3 43.04,55 v42.88,55.17
  Bottom 0.203: v42.88,55.17 23.98,74.02 23.98,76.22 22.61,77.6 19.3,77.6 17.65,79.25 17.65,79.97 JP1.4
CAM1_1
  Top 0.203: U3.54 33.54,35.7 26.52,28.68 26.52,16.41 27.93,15 | 27.93,15 27.94,14.99 | JP4.8 27.93,15
CAM1_2
  Top 0.203: U3.57 35.04,35.3 30.35,30.61 30.35,19.97 | 30.35,19.97 30.35,19.94 | JP3.9 30.35,19.97
CAM2_1
  Top 0.203: U3.39 27.6,44.49 24.77,41.66 24.77,32 16.36,23.6 16.36,16.28 17.64,15 | 17.64,15 17.65,14.99 | JP4.4 17.64,15
CAM2_2
  Top 0.203: U3.42 28,42.99 26.29,41.27 26.29,31.62 20.19,25.53 20.19,19.97 | 20.19,19.97 20.19,19.94 | JP3.5 20.19,19.97
CAM_PWR_EN
  Top 0.203: U3.41 27.87,43.49 25.78,41.4 25.78,31.75 18.9,24.87 18.9,16.28 20.18,15 | 20.18,15 20.19,14.99 | JP4.5 20.18,15
CAM_STAT_1
  Top 0.203: U3.55 34.04,35.57 27.81,29.34 27.81,19.97 | 27.81,19.97 27.81,19.94 | JP3.8 27.81,19.97
CAM_STAT_2
  Top 0.203: U3.40 27.73,43.99 25.27,41.53 25.27,31.88 17.65,24.26 17.65,19.97 | 17.65,19.97 17.65,19.94 | JP3.4 17.65,19.97
CS  (via drill 0.6)
  Top 0.203: U3.19 35.04,54.98 v35.56,55.5 | v29.72,52.45 24.77,57.4 17.27,57.4 15.37,55.5 15.37,51.17 U1.3
  Bottom 0.203: v35.56,55.5 32.77,55.5 v29.72,52.45
DEPLOY1  (via drill 0.6)
  Top 0.203: U3.77 47.12,39.49 47.37,39.24 47.37,38.23 v47.62,37.97 | v58.8,45.34 58.42,45.72 58.42,50.55 44.3,64.54 44.3,77.5 43.05,78.74 43.05,80.01 JP1.14
  Bottom 0.203: v47.62,37.97 53.59,37.97 58.8,43.18 v58.8,45.34
DEPLOY2  (via drill 0.6)
  Top 0.203: U3.76 46.04,37.65 v46.74,36.96 | v60.07,45.21 59.18,46.1 59.18,50.42 45.59,64.01 45.59,75.03 | 45.59,75.03 45.59,75.06 | 45.59,75.03 JP2.15
  Bottom 0.203: v46.74,36.96 53.21,36.96 60.07,43.81 v60.07,45.21
FLIGHT
  Top 0.203: U3.82 46.09,42.04 47.5,42.04 49.4,40.13 49.4,38.35 39.22,28.17 39.22,17.42 40.5,16.14 | 40.5,16.14 40.51,14.99 | JP4.13 40.5,16.14
GND  (via drill 0.51, 0.6)
  Top 0.203: 82.84,81.19 82.78,81.23 82.58,81.23 GYR1.11 | C13.2 11.96,63.58 11.76,63.37 11.76,63.08 | 71.42,89.59 71.83,89.59 ACC1.12 | GYR1.9 82.6,80.24 82.8,80.24 82.84,80.19 | 64.26,64.54 64.29,64.51 U5.4 64.26,62.97 64.26,64.52 | U5.17 63.65,58.26 63.65,57.63 63.14,57.12 63.14,56.24 | U3.32 29.46,47.95 29.06,47.95 29.06,47.99 | 46.97,41.49 46.94,41.45 46.74,41.45 U3.81 44.74,41.49 44.7,41.53 | 39.04,52.02 39.01,52.02 39.01,52.43 U3.11 39.04,56.84 v38.91,56.97 38.86,57.02 | U3.62 37.54,35.1 v38.02,34.62 | 44.83,50.42 44.9,50.49 U3.99 47.31,50.49 47.37,50.55 47.37,55.63 46.86,56.13 46.91,56.19 v46.91,56.21
  Bottom 0.203: v77.11,82.47 76.5,83.08 v75.49,83.08
  other vias: 23.55,44.65 64.29,64.44 79.98,77.17 68.76,88.01 77.8,73.46 42.85,41.22 27.1,49.86 7.8,51 6.78,49.99 59.87,31.95 70.28,19 66.85,23.7 62.92,31.57 68.88,38.94 59.61,34.37 56.44,35.51 66.09,15.82 76.5,12.78 74.47,12.78 72.44,12.78 18.59,63.07 61.37,51.74 12.62,67.13 12.24,60.66 55.68,49.86 29.9,36.91 51.87,40.21
  pour Bottom: 0,0 160,0 160,100 0,100
  pour Top (isolate 0.254, rank 6): 0,0 160,0 160,100 0,100
GPIO0
  Top 0.203: U3.24 32.54,56.1 21.44,67.21 21.44,76.35 20.19,77.6 20.19,80.01 JP1.5
GPIO1
  Top 0.203: U3.23 33.04,56.37 22.73,66.67 22.73,75.03 | 22.73,75.03 22.73,75.06 | 22.73,75.03 JP2.6
GPIO2
  Top 0.203: U3.16 36.54,57.78 36.45,57.78 23.98,70.26 23.98,76.22 22.73,77.47 22.73,80.01 JP1.6
GPIO3
  Top 0.203: U3.15 37.04,58.17 36.96,58.17 25.27,69.85 25.27,75.03 | 25.27,75.03 25.27,75.06 | 25.27,75.03 JP2.7
HP  (via drill 0.61)
  Top 0.203: GYR2.13 76.17,17.3 76.78,17.3 76.78,16.08 76.99,16.08 R21.2 77.39,16.08 v77.39,17.09 | v66.78,17.5 65.2,17.5 GYR3.13
  Bottom 0.203: v66.78,17.5 67.18,17.09 v77.39,17.09
LAUNCH
  Top 0.203: U3.84 46.11,43.05 48.01,43.05 50.42,40.64 50.42,37.72 41.76,29.06 41.76,16.28 43.04,15 | 43.04,15 43.05,14.99 | JP4.14 43.04,15
LAUNCHER_EN
  Top 0.203: U3.56 34.54,35.43 29.06,29.95 29.06,16.28 30.34,15 | 30.34,15 30.35,14.99 | JP4.9 30.34,15
LIGHT1
  Top 0.203: U3.94 48.37,47.99 49.53,49.15 49.53,57.91 32.89,74.55 32.89,75.03 | 32.89,75.03 32.89,75.06 | 32.89,75.03 JP2.10
LIGHT2
  Top 0.203: U3.95 48.11,48.49 49.02,49.4 49.02,57.66 33.66,73.03 32.89,73.03 31.57,74.35 31.57,78.79 30.35,80.01 30.34,80 JP1.9
LIGHT3
  Top 0.203: U3.96 47.85,48.99 48.51,49.66 48.51,57.4 33.4,72.52 32.51,72.52 30.1,74.93 30.17,75 JP2.9
LIGHT4
  Top 0.203: U3.97 47.59,49.49 48.01,49.91 48.01,57.15 33.27,71.88 31.5,71.88 29.06,74.32 29.06,78.77 27.81,80.01 27.8,80 JP1.8
M1+
  Top 0.203: U3.59 36.04,35.03 32.89,31.88 32.89,19.97 | 32.89,19.97 32.89,19.94 | JP3.10 32.89,19.97
M1-
  Top 0.203: JP3.12 37.97,20.03 37.97,27.58 41.53,31.14 41.53,36.98 U3.70
M1_LIM1
  Top 0.203: 22.73,19.97 22.73,19.94 | JP3.6 22.73,19.97 | 22.73,19.97 22.73,26.8 32,36.07 32,36.96 32.01,36.96 U3.51
M1_LIM2
  Top 0.203: U3.50 27.69,38.99 26.8,38.1 26.8,31.5 21.44,26.14 21.44,16.41 22.73,15.11 22.7,15.08 JP4.6
M2+
  Top 0.203: U3.60 36.54,34.89 34.14,32.49 34.14,18.77 37.96,15 | 37.96,15 37.97,14.99 | JP4.12 37.96,15
M2-
  Top 0.203: U3.58 35.54,35.16 31.57,31.22 31.6,16.28 32.88,15 | 32.88,15 32.89,14.99 | JP4.10 32.88,15
M2_LIM1
  Top 0.203: U3.36 27.19,45.99 23.37,42.16 23.37,32.51 12.6,21.74 12.6,19.91 12.54,19.97 JP3.2
M2_LIM2
  Top 0.203: U3.35 27.06,46.49 22.86,42.29 22.86,32.64 11.28,21.06 11.28,16.15 12.45,14.99 12.46,15 JP4.2
MISO  (via drill 0.51, 0.6)
  Top 0.203: v24.26,67.06 25.65,65.66 25.65,64.52 33.54,56.63 U3.22 33.53,52.43 v33.53,51.41 | v17.68,42.67 12.8,37.8 U2.7
  Bottom 0.203: 12.57,80.01 JP1.2 12.56,80 12.57,80.01 | v24.26,67.06 22.1,69.22 13.59,69.22 8.51,74.3 8.51,77.34 9.91,77.34 12.57,80.01 | v17.68,42.67 24.79,42.67 v33.53,51.41
MOSI  (via drill 0.6)
  Top 0.203: U3.21 34.04,58.67 v33.78,58.93 | U1.5 12.6,52.02 12.6,53.24 8.53,57.3 6.5,57.3 5.89,57.91 5.89,66.24 12.8,73.15 12.8,74.17 JP2.2
  Bottom 0.203: 12.57,75.03 12.57,75.06 | JP2.2 12.57,75.03 | 12.57,75.03 12.57,72.9 15.75,69.72 22.99,69.72 v33.78,58.93
N$5  (via drill 0.6)
  Top 0.203: R9.2 67.36,38.38 67.36,40.21 $$U$1.3 67.36,41.07 67.31,41.02 v67.31,43.69 | U3.43 31.31,42.49 33.15,44.32 33.15,46.86 v34.67,48.39
  Bottom 0.203: v34.67,48.39 35.94,48.39 37.34,46.99 64.01,46.99 v67.31,43.69
N$7  (via drill 0.51)
  Top 0.203: L1.2 10.49,62.64 10.49,63.45 C13.1 10.77,65.02 v10.77,65.84 | v43.28,49.99 45.31,49.99 U3.98
  Bottom 0.203: v43.28,49.99 35.97,57.3 26.62,57.3 18.09,65.84 v10.77,65.84
N$9  (via drill 0.6)
  Top 0.203: R8.2 67.36,49.96 67.36,48.13 $$U$1.6 67.42,47.13 67.44,47.12 67.31,46.99 67.31,44.96 66.04,43.69 v65.66,43.69 | U3.44 31.58,41.99 33.66,44.07 33.66,45.47 v34.67,46.48
  Bottom 0.203: v34.67,46.48 62.87,46.48 v65.66,43.69
N$10
  Top 0.203: U2.2 11.18,32.51 11.99,32.51 18.69,39.22 18.69,42.67 19.3,43.28 19.3,46.53 16.66,49.17 16.66,50.19 U1.2
N$11  (via drill 0.51)
  Top 0.203: v11.58,33.73 10.77,33.73 U2.3 | v14.22,49.38 14.22,50.19 U1.4
  Bottom 0.203: v11.58,33.73 11.58,46.74 v14.22,49.38
N$12
  Top 0.203: U2.5 9.35,35.97 7.92,35.97 5.28,38.61 5.28,49.99 8.33,53.03 11.38,53.03 11.58,52.83 11.58,52.02 U1.6
N$13
  Top 0.203: C100.2 22.5,55.93 22.3,55.93 22.3,55.12 Q100.3 22.06,54.19 23.88,52.38 24.92,52.38 25.32,51.97 25.32,49.99 27.82,47.49 U3.33
N$14
  Top 0.203: C101.2 23.78,48.9 | 23.78,48.9 23.93,49.02 23.93,49.63 Q100.1 | 23.78,48.9 23.78,48.89 25.68,46.99 U3.34
N$17
  Top 0.203: U5.16 63.19,57.86 61.62,56.29 60.68,56.29 C10.1
N$21  (via drill 0.6)
  Top 0.203: GYR1.20 v77.17,81.2 | C5.1 76.43,76.61 76.43,77.8 v75.74,78.49
  Bottom 0.203: v77.17,81.2 75.74,79.78 v75.74,78.49
N$22
  Top 0.203: C1.1 84.26,80.39 84.25,80.39 83.95,80.69 GYR1.10
N$24
  Top 0.203: 58.78,56.88 58.78,56.4 C10.2 58.8,56.26 | U5.12 60.98,60.09 58.78,57.89 58.78,56.29 58.8,56.26 | 58.8,56.26
N$27  (via drill 0.6)
  Top 0.203: U5.15 60.88,58.34 v60.71,58.17 | 58.67,53.59 | 58.67,53.59 C11.1 | v56.64,57.66 56.64,55.63 58.67,53.59
  Bottom 0.203: v60.71,58.17 57.15,58.17 v56.64,57.66
N$28
  Top 0.203: R22.2 62.56,16.48 62.56,17.09 GYR3.10
N$29  (via drill 0.51)
  Top 0.203: v26.21,51 29.46,51 U3.26 | v12.8,58.52 11.99,58.52 R7.2
  Bottom 0.203: v26.21,51 20.32,51 v12.8,58.52
N$30
  Top 0.203: ST.A 7.87,58.85 8.89,58.85 R7.1
N$31
  Top 0.203: GYR3.2 64.39,22.58 64.39,23.8 64.59,23.8 64.59,24.41 64.8,24.61 C18.1 65.61,25.63 65.61,27.46 C17.1
N$32
  Top 0.203: R23.1 63.98,29.9 64.8,29.9 C17.2
N$33
  Top 0.203: R23.2 63.58,27.66 63.58,25.63 C18.2 63.58,24.21 63.58,22.58 GYR3.3
N$34
  Top 0.203: R24.2 61.95,23.8 62.56,23.8 62.56,22.58 GYR3.4
N$42  (via drill 0.61)
  Top 0.203: v71.5,18.11 71.5,16.08 R25.2 | v73.74,19.13 73.74,18.31 GYR2.10
  Bottom 0.203: v71.5,18.11 72.52,19.13 v73.74,19.13
N$45
  Top 0.203: GYR2.2 75.36,22.58 75.36,23.8 75.56,23.8 75.56,24.41 75.97,24.82 C22.1 76.58,25.63 76.58,27.46 C21.1
N$46
  Top 0.203: R26.1 74.95,29.9 75.77,29.9 C21.2
N$47
  Top 0.203: R26.2 74.55,27.66 74.55,25.63 C22.2 74.35,24.21 74.35,22.58 GYR2.3
N$53
  Top 0.406: XBEE2.10 95.44,13.9 98.04,16.51 99.69,16.51 | 99.69,16.51 99.82,16.51 100.08,16.26 100.08,14.61 100.2,14.48 100.19,14.47 U$22.3 | U$22.2 101.42,16.31 101.22,16.51 | 99.69,16.51 101.22,16.51 | 101.22,16.51 102.36,16.51 | U$22.1 102.69,16.18 102.36,16.51 | 102.36,16.51 106.17,16.51 110.49,12.19 116.2,12.19 117.97,13.95 | 117.97,13.95 117.98,13.97 | 117.97,13.95 XBEE1.10
PAYLOAD_CHK  (via drill 0.6)
  Top 0.203: U3.7 41.04,59.67 v40.13,60.58
  Bottom 0.203: v40.13,60.58 42.04,62.48 42.04,74.04 43.02,75.02 | 43.02,75.02 43.05,75.06 | 43.02,75.02 JP2.14
PD
  Top 0.203: GYR2.12 75.36,17.09 75.36,16.08 R20.2 75.97,16.08 76.17,15.88 76.17,14.86 78.41,14.86 78.41,11.58 68.89,11.58 64.39,16.08 64.39,17.09 GYR3.12
PROBE1_CONTACT
  Top 0.203: U3.53 33.04,35.84 25.27,28.07 25.27,19.97 | 25.27,19.97 25.27,19.94 | JP3.7 25.27,19.97
PROBE1_TRIG
  Top 0.203: U3.52 32.54,35.97 23.98,27.41 23.98,16.28 25.26,15 | 25.26,15 25.27,14.99 | JP4.7 25.26,15
PROBE2_CONTACT
  Top 0.203: U3.38 27.46,44.99 24.26,41.78 24.26,32.13 15.11,22.99 15.11,19.94 15.08,19.97 JP3.3
PROBE2_TRIG
  Top 0.203: U3.37 27.3,45.49 23.77,41.96 23.77,32.28 13.82,22.33 13.82,16.28 15.1,15 | 15.1,15 15.11,14.99 | JP4.3 15.1,15
PWM1  (via drill 0.6)
  Top 0.203: U3.17 36.07,52.99 36.07,42.04 36.58,41.53 36.58,40.51 36.2,40.13 34.67,40.13 v34.16,39.62 | JP3.11 35.4,20.03 35.43,20.07 35.18,20.32 v35.18,31.75
  Bottom 0.203: v34.16,39.62 34.16,32.77 v35.18,31.75
PWM2  (via drill 0.6)
  Top 0.203: 35.56,52.43 U3.18 35.54,52.98 35.56,52.96 v35.56,41.15
  Bottom 0.203: JP4.11 35.76,15.85 36.58,15.85 36.58,16.05 37.19,16.66 44.3,16.66 44.3,29.87 35.56,38.61 v35.56,41.15
PWR_FAULT  (via drill 0.6)
  Top 0.203: U3.5 42.04,61.59 v40.77,62.87
  Bottom 0.203: JP2.12 37.94,74.96 40.77,72.14 v40.77,62.87
RFB_PIN  (via drill 0.6)
  Top 0.203: U3.25 32.04,55.84 25.53,62.36 v24.51,62.36
  Bottom 0.203: v24.51,62.36 21.72,65.15 21.72,68.2 21.21,68.71 13.46,68.71 8,74.17 8,80.39 9.27,81.66 13.59,81.66 15.24,80.01 15.23,80 JP1.3
RSSI1  (via drill 0.6)
  Top 0.203: XBEE1.6 115.72,21.95 114.81,22.86 91.95,22.86 87.76,27.05 87.25,27.05 80.52,33.78 64.64,33.78 53.21,45.21 53.21,48.9 51.31,48.9 50.42,48.01 | 46.05,47.5 U3.93 46.09,47.49 46.1,47.5 49.91,47.5 50.42,48.01 | 50.42,48.01 v50.42,50.93
  Bottom 0.203: v50.42,50.93 50.42,77.09 49.78,77.72 35.18,77.72 32.89,80.01 32.88,80 JP1.10
RSSI2  (via drill 0.6)
  Top 0.203: XBEE2.6 91.3,22.74 87.76,26.42 87.12,26.42 80.14,33.27 64.39,33.27 50.67,46.99 | U3.92 50.67,46.99 | 50.67,46.99 v51.69,48.01
  Bottom 0.203: v51.69,48.01 51.69,76.45 49.91,78.23 37.21,78.23 35.43,80.01 35.42,80 JP1.11
SCK  (via drill 0.51)
  Top 0.203: 34.54,52.02 34.54,52.43 U3.20 34.54,53.65 34.54,57.71 v34.95,58.12 | v10.36,49.38 10.36,50.19 U1.7 | v9.96,68.28 14.83,73.15 14.83,74.17 JP2.3
  Bottom 0.203: v34.95,58.12 34.95,59.54 25.4,69.09 24.79,69.09 20.52,73.36 14.83,73.36 14.83,74.17 JP2.3 | v10.36,49.38 10.36,65.02 9.96,65.43 v9.96,68.28
SCL  (via drill 0.51)
  Top 0.203: v71.93,44.91 71.93,52.22 Q4.3 | v66.24,39.22 66.24,40.23 $$U$1.2 | ACC1.14 71.53,91.03 72.75,91.03 v72.75,91.44 72.95,91.64 73.36,91.64 74.57,90.42 74.57,88.39 75.59,88.39 BAR100.6 | v72.95,83.52 71.93,83.52 TMP100.1 | v75.59,80.87 76,80.47 76,80.26 76.61,79.65 78.03,79.65 GYR1.23 | R12.2 72.54,73.56 v72.54,77.83 69.29,77.83 65.23,81.89 24.59,81.89 23.98,81.28 23.98,79.25 27.43,75.79 JP2.8
  Bottom 0.203: v66.24,39.22 v71.93,44.91 72.14,45.31 72.14,77.62 v72.54,77.83 v75.59,80.87 v72.95,83.52 72.75,83.92 v72.75,91.44
SCL1.8V  (via drill 0.61)
  Top 0.203: U5.20 65.38,59.36 66.12,60.1 66.25,60.09 U5.24 66.75,60.12 67.36,60.12 67.36,61.34 70.21,61.34 v70.61,61.14 70.61,60.33 R32.1 | v71.02,56.87 71.02,55.04 Q4.2
  Bottom 0.203: v71.02,56.87 71.02,61.14 v70.61,61.14
SDA  (via drill 0.51)
  Top 0.203: $$U$1.7 66.04,48.16 66.04,48.97 65.43,49.58 65.43,52.63 Q5.3 65.43,53.24 70.71,53.24 70.92,53.44 73.97,53.44 80.26,59.74 80.26,71.12 | 72.95,82.3 71.93,82.3 TMP100.6 | 72.95,82.3 75.79,85.14 75.79,86.97 BAR100.7 75.59,87.17 74.57,87.17 74.17,87.58 74.17,89.81 73.76,90.22 72.95,90.22 ACC1.13 | 78.03,79.05 76.4,79.05 76.4,79.25 76.2,79.25 76.2,79.45 74.98,79.45 72.95,81.48 v72.95,81.89 72.95,82.3 | 78.03,79.05 78.23,79.05 78.23,79.12 GYR1.24 | 80.26,71.12 81.08,71.12 82.91,72.95 82.91,75.39 82.09,76.2 79.45,76.2 78.03,77.62 78.03,79.05 | 80.26,71.12 74.78,71.12 R11.2
  Bottom 0.203: v72.95,81.89 26.42,81.89 26.01,81.48 26.01,80.47 JP1.7
SDA1.8V  (via drill 0.61)
  Top 0.203: U5.25 66.58,60.63 65.99,60.63 64.85,59.49 | U5.19 64.85,59.49 | v64.11,56.87 64.11,55.24 Q5.2 | v64.11,59.51 64.85,59.51 64.85,59.49 | v66.95,57.89 67.36,57.89 67.36,59.11 67.77,59.11 67.77,59.92 R33.1
  Bottom 0.203: v64.11,59.51 v64.11,56.87 64.52,57.07 66.14,57.07 v66.95,57.89
SEP
  Top 0.203: U3.83 46.1,42.55 47.75,42.55 49.91,40.39 49.91,38.1 40.39,28.57 40.39,20.07 40.48,19.97 | 40.48,19.97 40.51,19.94 | JP3.13 40.48,19.97
SEP1  (via drill 0.6)
  Top 0.203: U3.78 47.39,39.99 v48.39,38.99 | v57.53,45.47 57.53,50.67 35.43,72.77 35.43,75.03 | 35.43,75.03 35.43,75.06 | 35.43,75.03 JP2.11
  Bottom 0.203: v48.39,38.99 53.98,38.99 57.53,42.55 v57.53,45.47
SEP2  (via drill 0.6)
  Top 0.203: U3.6 41.54,60.82 v39.24,63.12 | 37.96,80 37.85,79.88 | 37.96,80 37.97,80.01 | 37.96,80 JP1.12 | v36.68,76.71 36.68,78.72 37.96,80
  Bottom 0.203: v39.24,63.12 39.24,71.75 36.68,74.32 v36.68,76.71
ST  (via drill 0.61)
  Top 0.203: R10.2 73.94,16.08 74.35,16.48 74.35,17.09 GYR2.11 74.55,18.31 74.55,18.52 74.75,18.72 74.75,19.33 v74.95,19.53 | v63.17,19.94 63.17,18.92 63.37,18.72 63.37,18.31 GYR3.11
  Bottom 0.203: v63.17,19.94 66.02,22.78 72.72,22.78 74.95,20.55 v74.95,19.53
TELEM_TX  (via drill 0.6)
  Top 0.203: JP1.15 46.84,78.72 46.84,63.52 59.69,50.67 59.69,46.86 60.96,45.59 60.96,43.31 v59.56,41.91 | v49.4,34.42 48.64,34.42 v45.72,31.5 | v40.51,35.05 39.24,35.05 38.48,35.81 38.48,36.96 38.51,36.96 U3.64
  Bottom 0.203: v59.56,41.91 52.07,34.42 v49.4,34.42 | v45.72,31.5 42.16,35.05 v40.51,35.05
XBEE-RX1  (via drill 0.6)
  Top 0.203: U3.46 32.73,40.99 v34.54,42.8 | XBEE1.3 114.92,27.95 114.94,27.94 114.81,27.81 v112.9,27.81
  Bottom 0.203: v34.54,42.8 43.18,42.8 45.09,40.89 45.09,34.29 46.35,33.02 53.21,33.02 53.59,32.64 53.59,15.24 57.4,11.43 96.52,11.43 v112.9,27.81
XBEE-RX2  (via drill 0.6)
  Top 0.203: U3.13 38.04,50.09 v44.07,44.07 | v56.26,44.07 56.52,44.2 57.78,42.93 57.78,41.4 64.9,34.29 80.77,34.29 87.12,27.94 88.27,27.94 XBEE2.3
  Bottom 0.203: v44.07,44.07 v56.26,44.07
XBEE-TX1  (via drill 0.6)
  Top 0.203: U3.45 31.84,41.49 v34.54,44.2 | XBEE1.2 117.88,29.95 117.86,29.97 v116.08,29.97
  Bottom 0.203: v116.08,29.97 115.57,29.46 112.27,29.46 94.74,11.94 94.36,11.94 57.53,11.94 54.1,15.37 54.1,32.77 53.34,33.53 46.48,33.53 45.59,34.42 45.59,41.27 42.67,44.2 v34.54,44.2
XBEE-TX2  (via drill 0.6)
  Top 0.203: U3.12 38.54,50.87 v43.81,45.59 | v55.37,45.59 56.13,45.59 58.29,43.43 58.29,41.66 65.15,34.8 81.03,34.8 85.85,29.97 91.19,29.97 91.3,29.86 | 91.3,29.86 91.31,29.84 | 91.3,29.86 XBEE2.2
  Bottom 0.203: v43.81,45.59 v55.37,45.59
XOUT-1X
  Top 0.203: C16.1 59.11,15.88 60.33,15.88 R22.1 60.53,16.48 60.53,17.7 61.09,17.7 | 61.09,17.7 61.75,17.7 GYR3.9 | U3.86 49.74,43.99 57.53,36.2 57.53,21.34 61.09,17.78 61.09,17.7
XOUT-4X
  Top 0.203: U3.87 49.87,44.49 58.04,36.32 58.04,21.59 60.58,19.05 61.34,19.05 GYR3.8
YOUT-1X
  Top 0.203: 60.07,25.81 60.02,25.81 60.02,23.16 60.43,22.76 61.65,22.76 GYR3.5 | 60.07,25.81 61.04,25.81 R24.1 | U3.89 46.07,45.47 50.16,45.47 61.47,34.16 R24.1 | R24.1 61.47,25.78 | 60.07,25.81 60.07,25.78 59.97,25.89 C19.1
YOUT-4X
  Top 0.203: U3.88 46.08,44.96 50.04,44.96 58.55,36.45 58.55,22.73 60.58,20.7 61.34,20.7 61.33,20.71 GYR3.6
ZOUT-1X
  Top 0.203: GYR2.9 72.72,17.09 72.52,17.09 72.52,14.05 71.91,14.05 R25.1 70.89,14.05 70.08,14.05 C20.1 69.49,14.02 69.47,14.1 68.2,14.1 67.31,14.99 67.31,16.51 69.34,18.54 69.34,30.86 67.94,32.26 64.01,32.26 50.28,45.99 U3.90
ZOUT-4X
  Top 0.203: U3.91 50.41,46.49 64.14,32.77 68.2,32.77 69.85,31.11 69.85,20.7 71.44,19.11 GYR2.8